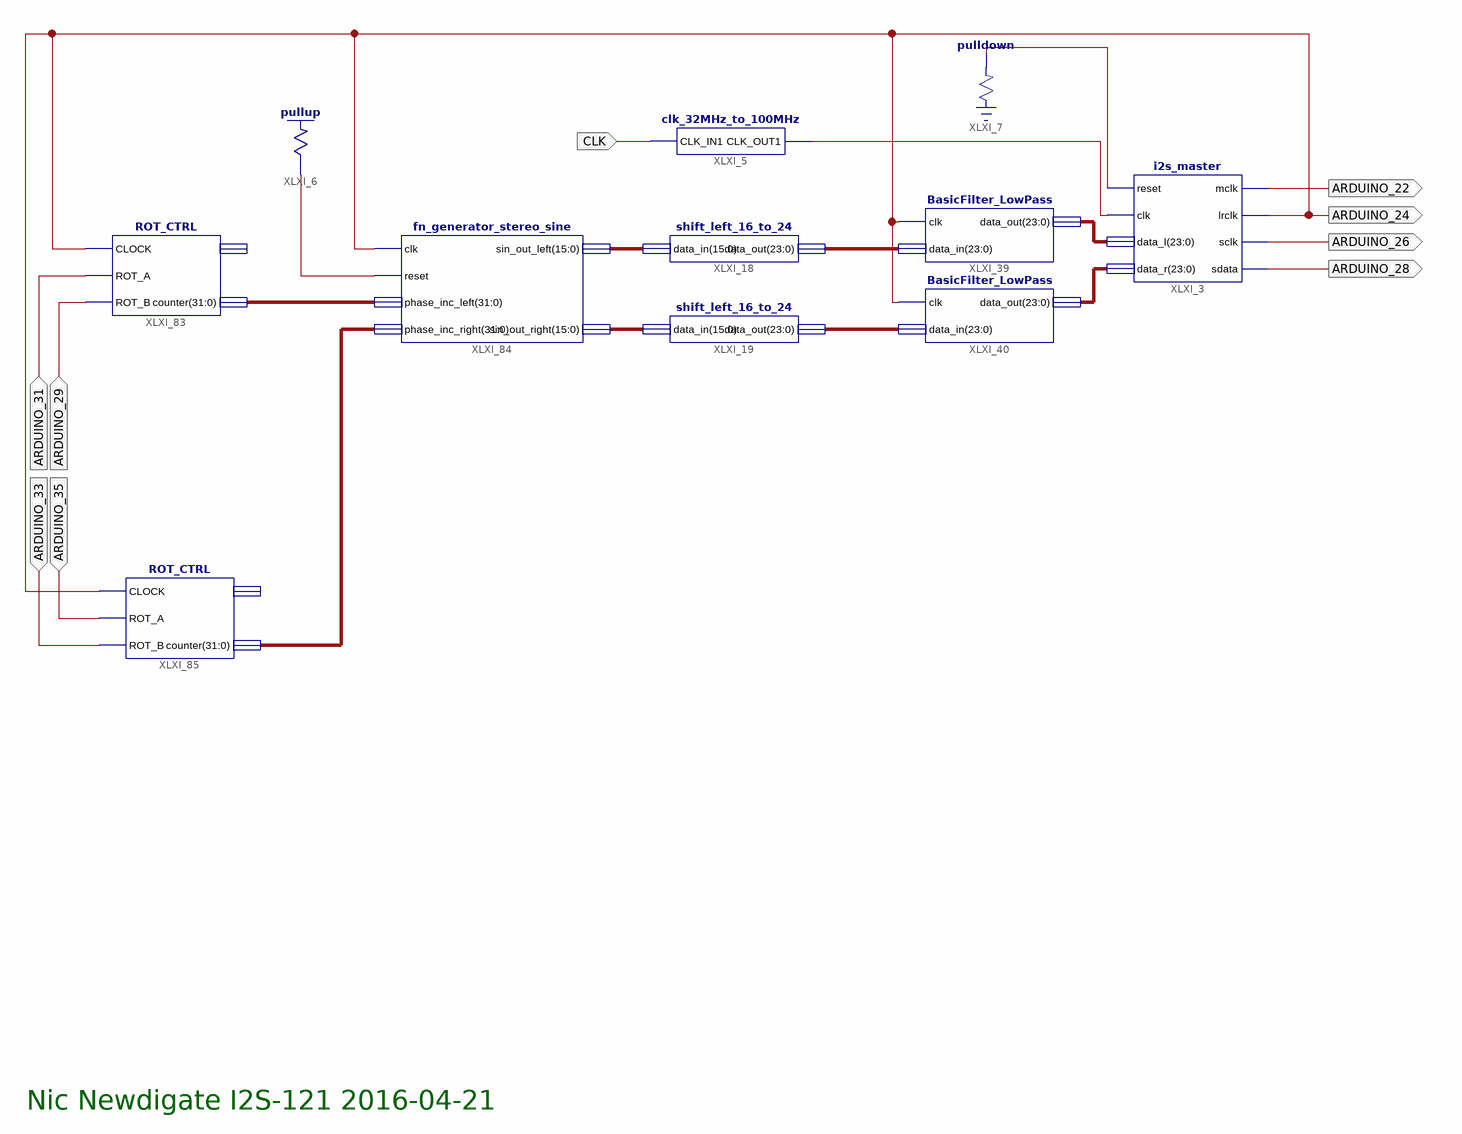
[diagram p0: schematic sheet 1]
// Xilinx ISE schematic Papilio_Audio_Modular_top.sch (spartan6) as structural Verilog: 11 symbols, 9 ports
module Papilio_Audio_Modular_top (
  input  CLK,
  input  ARDUINO_29,
  input  ARDUINO_31,
  input  ARDUINO_35,
  input  ARDUINO_33,
  output ARDUINO_22,
  output ARDUINO_26,
  output ARDUINO_24,
  output ARDUINO_28
);

  wire XLXN_6, XLXN_15, XLXN_396;
  wire [15:0] XLXN_76, XLXN_321;
  wire [23:0] XLXN_390, XLXN_391, XLXN_394, XLXN_395;
  wire [31:0] accum, XLXN_322;

  \pulldown  XLXI_7 (.O(XLXN_15));
  \pullup  XLXI_6 (.O(XLXN_6));
  clk_32MHz_to_100MHz XLXI_5 (.CLK_IN1(CLK), .CLK_OUT1(XLXN_396));
  i2s_master XLXI_3 (
    .reset(XLXN_15), .clk(XLXN_396), .data_l(XLXN_394), .data_r(XLXN_395), .mclk(ARDUINO_22),
    .lrclk(ARDUINO_24), .sclk(ARDUINO_26), .sdata(ARDUINO_28));
  ROT_CTRL XLXI_83 (.CLOCK(ARDUINO_24), .ROT_A(ARDUINO_31), .ROT_B(ARDUINO_29), .counter(accum));  // open: DIRECTION
  fn_generator_stereo_sine XLXI_84 (
    .clk(ARDUINO_24), .reset(XLXN_6), .phase_inc_left(accum), .phase_inc_right(XLXN_322),
    .sin_out_left(XLXN_76), .sin_out_right(XLXN_321));
  ROT_CTRL XLXI_85 (.CLOCK(ARDUINO_24), .ROT_A(ARDUINO_35), .ROT_B(ARDUINO_33), .counter(XLXN_322));  // open: DIRECTION
  BasicFilter_LowPass XLXI_40 (.clk(ARDUINO_24), .data_in(XLXN_391), .data_out(XLXN_395));
  BasicFilter_LowPass XLXI_39 (.clk(ARDUINO_24), .data_in(XLXN_390), .data_out(XLXN_394));
  shift_left_16_to_24 XLXI_19 (.data_in(XLXN_321), .data_out(XLXN_391));
  shift_left_16_to_24 XLXI_18 (.data_in(XLXN_76), .data_out(XLXN_390));

  // Notes on the sheet:
  //   Nic Newdigate I2S-121 2016-04-21
endmodule
